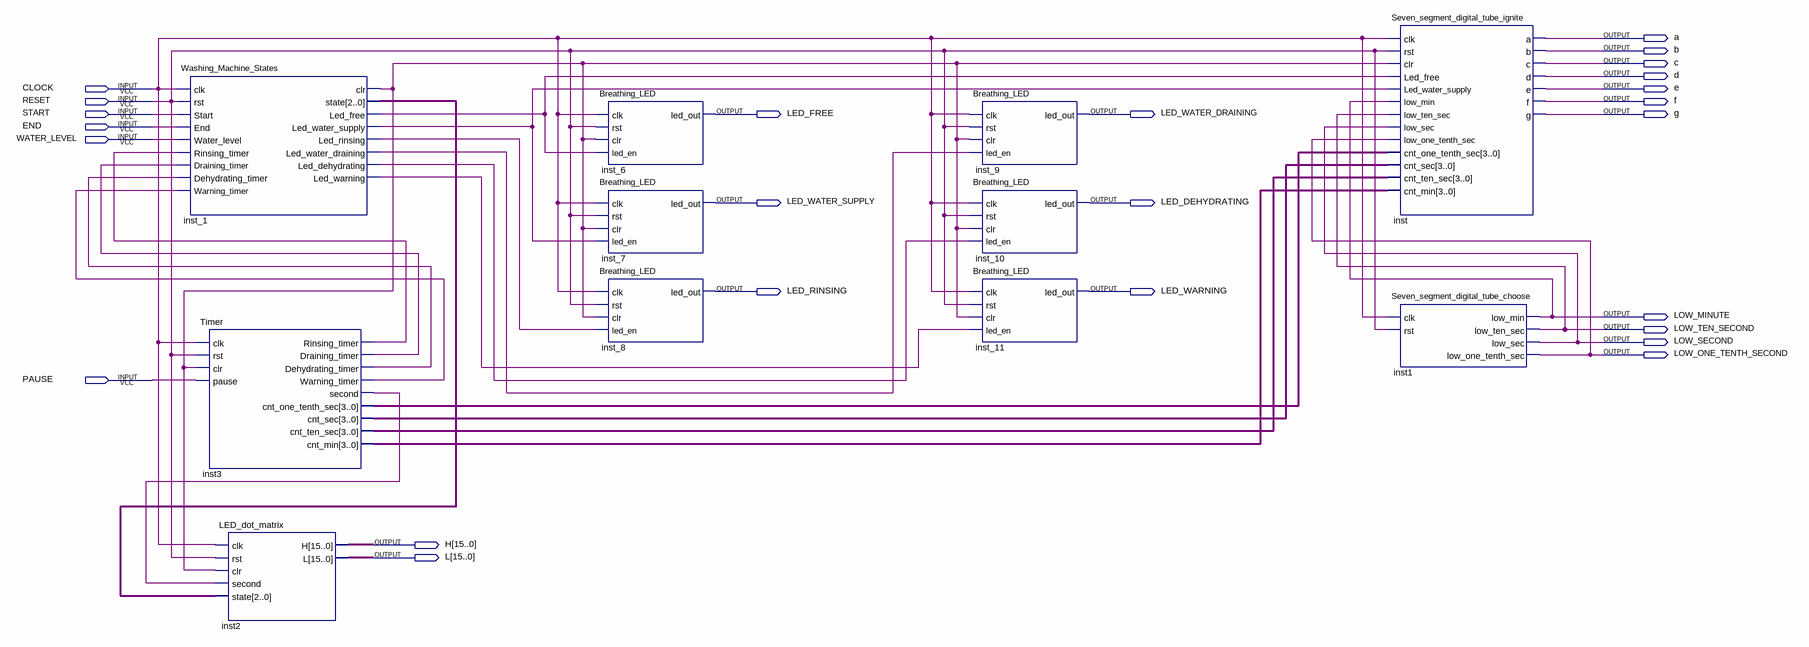
[diagram p0: schematic sheet]
// Quartus schematic Washing_Machine.bdf as structural Verilog: 11 symbols, 25 pins
module Washing_Machine (
  input  CLOCK,
  input  RESET,
  input  START,
  input  END,
  input  WATER_LEVEL,
  input  PAUSE,
  output a,
  output b,
  output c,
  output d,
  output e,
  output f,
  output LED_FREE,
  output LED_WATER_DRAINING,
  output g,
  output LED_WATER_SUPPLY,
  output LED_DEHYDRATING,
  output LED_RINSING,
  output LED_WARNING,
  output LOW_MINUTE,
  output LOW_TEN_SECOND,
  output LOW_SECOND,
  output LOW_ONE_TENTH_SECOND,
  output [15:0] H,
  output [15:0] L
);

  wire inst3_dehydrating_timer, inst3_draining_timer, inst3_rinsing_timer, inst3_second, inst3_warning_timer,
       inst_1_clr, inst_1_led_dehydrating, inst_1_led_free, inst_1_led_rinsing, inst_1_led_warning,
       inst_1_led_water_draining, inst_1_led_water_supply;
  wire [2:0] inst_1_state;
  wire [3:0] inst3_cnt_min, inst3_cnt_one_tenth_sec, inst3_cnt_sec, inst3_cnt_ten_sec;

  Washing_Machine_States inst_1 (
    .clk(CLOCK), .rst(RESET), .Start(START), .End(END), .Water_level(WATER_LEVEL),
    .Rinsing_timer(inst3_rinsing_timer), .Draining_timer(inst3_draining_timer),
    .Dehydrating_timer(inst3_dehydrating_timer), .Warning_timer(inst3_warning_timer), .clr(inst_1_clr),
    .state(inst_1_state), .Led_free(inst_1_led_free), .Led_water_supply(inst_1_led_water_supply),
    .Led_rinsing(inst_1_led_rinsing), .Led_water_draining(inst_1_led_water_draining),
    .Led_dehydrating(inst_1_led_dehydrating), .Led_warning(inst_1_led_warning));
  Timer inst3 (
    .clk(CLOCK), .rst(RESET), .clr(inst_1_clr), .pause(PAUSE), .Rinsing_timer(inst3_rinsing_timer),
    .Draining_timer(inst3_draining_timer), .Dehydrating_timer(inst3_dehydrating_timer),
    .Warning_timer(inst3_warning_timer), .second(inst3_second), .cnt_one_tenth_sec(inst3_cnt_one_tenth_sec),
    .cnt_sec(inst3_cnt_sec), .cnt_ten_sec(inst3_cnt_ten_sec), .cnt_min(inst3_cnt_min));
  LED_dot_matrix inst2 (
    .clk(CLOCK), .rst(RESET), .clr(inst_1_clr), .second(inst3_second), .state(inst_1_state), .H(H), .L(L));
  Breathing_LED inst_6 (.clk(CLOCK), .rst(RESET), .clr(inst_1_clr), .led_en(inst_1_led_free), .led_out(LED_FREE));
  Breathing_LED inst_7 (
    .clk(CLOCK), .rst(RESET), .clr(inst_1_clr), .led_en(inst_1_led_water_supply), .led_out(LED_WATER_SUPPLY));
  Breathing_LED inst_8 (.clk(CLOCK), .rst(RESET), .clr(inst_1_clr), .led_en(inst_1_led_rinsing), .led_out(LED_RINSING));
  Breathing_LED inst_9 (
    .clk(CLOCK), .rst(RESET), .clr(inst_1_clr), .led_en(inst_1_led_water_draining),
    .led_out(LED_WATER_DRAINING));
  Breathing_LED inst_10 (
    .clk(CLOCK), .rst(RESET), .clr(inst_1_clr), .led_en(inst_1_led_dehydrating), .led_out(LED_DEHYDRATING));
  Breathing_LED inst_11 (
    .clk(CLOCK), .rst(RESET), .clr(inst_1_clr), .led_en(inst_1_led_warning), .led_out(LED_WARNING));
  Seven_segment_digital_tube_ignite inst (
    .clk(CLOCK), .rst(RESET), .clr(inst_1_clr), .Led_free(inst_1_led_free),
    .Led_water_supply(inst_1_led_water_supply), .low_min(LOW_MINUTE), .low_ten_sec(LOW_TEN_SECOND),
    .low_sec(LOW_SECOND), .low_one_tenth_sec(LOW_ONE_TENTH_SECOND),
    .cnt_one_tenth_sec(inst3_cnt_one_tenth_sec), .cnt_sec(inst3_cnt_sec), .cnt_ten_sec(inst3_cnt_ten_sec),
    .cnt_min(inst3_cnt_min), .a(a), .b(b), .c(c), .d(d), .e(e), .f(f), .g(g));
  Seven_segment_digital_tube_choose inst1 (
    .clk(CLOCK), .rst(RESET), .low_min(LOW_MINUTE), .low_ten_sec(LOW_TEN_SECOND), .low_sec(LOW_SECOND),
    .low_one_tenth_sec(LOW_ONE_TENTH_SECOND));
endmodule
